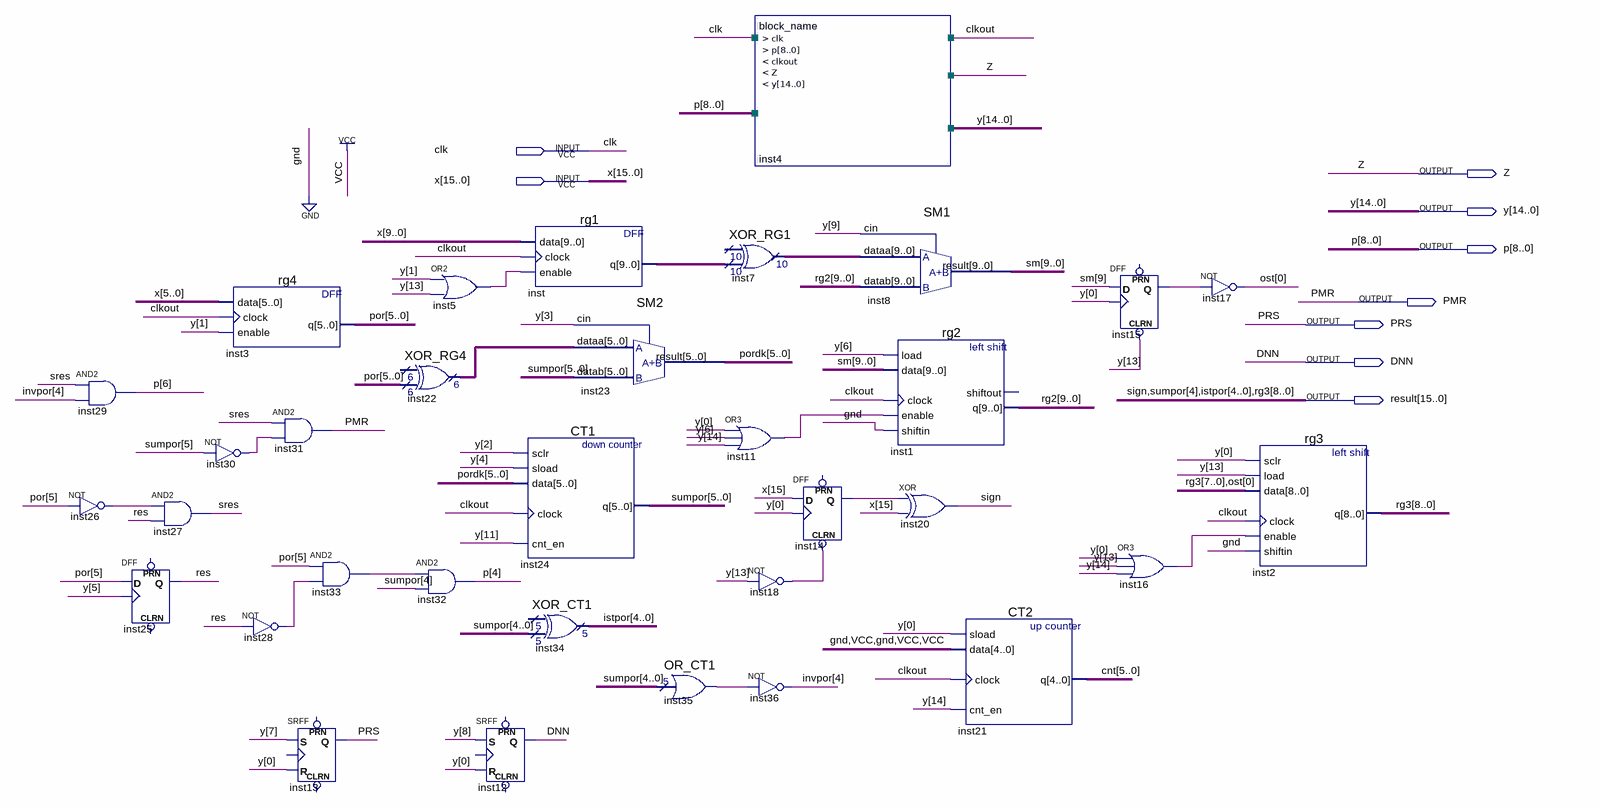
[diagram p0: schematic sheet]
// Quartus schematic Delenie.bdf as structural Verilog: 33 symbols, 9 pins
module Delenie (
  input  clk,
  input  [15:0] x,
  output Z,
  output [14:0] y,
  output [8:0] p,
  output PMR,
  output PRS,
  output DNN,
  output [15:0] result
);

  wire clkout, inst5_out, inst11_out, inst14_q, inst15_q, inst16_out, inst18_out, inst26_out, inst28_out,
       inst30_out, inst33_out, inst35_result, res, sres;
  wire [0:0] ost;
  wire [4:4] invpor;
  wire [5:0] cnt, inst22_result, por, pordk, sumpor;
  wire [9:0] inst7_result, inst_q, rg2, sm;

  and inst29 (p[6], sres, invpor[4]);
  not inst26 (inst26_out, por[5]);
  DFF inst25 (.CLK(y[5]), .D(por[5]), .Q(res));  // open: CLRN, PRN
  and inst27 (sres, inst26_out, res);
  rg4 inst3 (.data(x[5:0]), .clock(clkout), .enable(y[1]), .q(por));
  not inst30 (inst30_out, sumpor[5]);
  not inst28 (inst28_out, res);
  and inst31 (PMR, sres, inst30_out);
  and inst33 (inst33_out, por[5], inst28_out);
  SRFF inst13 (.S(y[7]), .R(y[0]), .Q(PRS));  // open: PRN, CLRN, CLK
  or inst5 (inst5_out, y[1], y[13]);
  XOR_RG4 inst22 (.data1x(por), .result(inst22_result));  // open: data0x
  and inst32 (p[4], inst33_out, result[14]);
  SRFF inst12 (.S(y[8]), .R(y[0]), .Q(DNN));  // open: PRN, CLRN, CLK
  rg1 inst (.data(x[9:0]), .clock(clkout), .enable(inst5_out), .q(inst_q));
  CT1 inst24 (
    .sclr(y[2]), .sload(y[4]), .data(pordk), .clock(clkout), .cnt_en(y[11]),
    .q({sumpor[5], result[14], sumpor[3:0]}));
  XOR_CT1 inst34 (.data1x({result[14], sumpor[3:0]}), .result(result[13:9]));  // open: data0x
  SM2 inst23 (.dataa(inst22_result), .datab({sumpor[5], result[14], sumpor[3:0]}), .cin(y[3]), .result(pordk));
  OR_CT1 inst35 (.data({result[14], sumpor[3:0]}), .result(inst35_result));
  XOR_RG1 inst7 (.data1x(inst_q), .result(inst7_result));  // open: data0x
  or inst11 (inst11_out, y[0], y[6], y[14]);
  block_name inst4 (.clk(clk), .p(p), .clkout(clkout), .Z(Z), .y(y));
  DFF inst14 (.CLRN(inst18_out), .CLK(y[0]), .D(x[15]), .Q(inst14_q));  // open: PRN
  not inst18 (inst18_out, y[13]);
  not inst36 (invpor[4], inst35_result);
  SM1 inst8 (.dataa(inst7_result), .datab(rg2), .cin(y[9]), .result(sm));
  rg2 inst1 (.load(y[6]), .data(sm), .clock(clkout), .enable(inst11_out), .shiftin(1'b0), .q(rg2));  // open: shiftout
  xor inst20 (result[15], inst14_q, x[15]);
  CT2 inst21 (.sload(y[0]), .data(5'b01011), .clock(clkout), .cnt_en(y[14]), .q(cnt));
  DFF inst15 (.CLRN(y[13]), .CLK(y[0]), .D(sm[9]), .Q(inst15_q));  // open: PRN
  or inst16 (inst16_out, y[0], y[13], y[14]);
  not inst17 (ost[0], inst15_q);
  rg3 inst2 (
    .sclr(y[0]), .load(y[13]), .data({result[7:0], ost[0]}), .clock(clkout), .enable(inst16_out),
    .shiftin(1'b0), .q(result[8:0]));

  // Other names for the same wires on the sheet: istpor[4:0] = result[13:9]; rg3[8:0] = result[8:0];
  //   sign = result[15]; sumpor[4] = result[14]
endmodule
